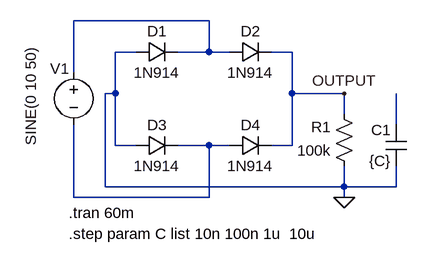
[diagram p0: schematic FullWaveBridgeRectifier.asc]
FullWaveBridgeRectifier.asc, the LTspice schematic file:
Version 4
SHEET 1 1288 680
WIRE 144 16 -64 16
WIRE 32 64 0 64
WIRE 144 64 144 16
WIRE 144 64 96 64
WIRE 176 64 144 64
WIRE 272 64 240 64
WIRE -64 96 -64 16
WIRE 0 128 0 64
WIRE 0 128 -16 128
WIRE 272 128 272 64
WIRE 352 128 272 128
WIRE 352 160 352 128
WIRE 432 176 432 128
WIRE 0 208 0 128
WIRE 32 208 0 208
WIRE 144 208 96 208
WIRE 176 208 144 208
WIRE 272 208 272 128
WIRE 272 208 240 208
WIRE -16 272 -16 128
WIRE 352 272 352 240
WIRE 352 272 -16 272
WIRE 432 272 432 240
WIRE 432 272 352 272
WIRE -64 288 -64 176
WIRE 144 288 144 208
WIRE 144 288 -64 288
WIRE 352 288 352 272
FLAG 352 288 0
FLAG 352 128 OUTPUT
SYMBOL voltage -64 80 R0
WINDOW 0 -36 10 Left 2
WINDOW 3 -66 -24 VRight 2
WINDOW 123 0 0 Left 0
WINDOW 39 0 0 Left 0
SYMATTR InstName V1
SYMATTR Value SINE(0 10 50)
SYMBOL diode 32 80 R270
WINDOW 0 32 32 VTop 2
WINDOW 3 0 32 VBottom 2
SYMATTR InstName D1
SYMATTR Value 1N914
SYMBOL diode 176 80 R270
WINDOW 0 32 32 VTop 2
WINDOW 3 0 32 VBottom 2
SYMATTR InstName D2
SYMATTR Value 1N914
SYMBOL diode 32 224 R270
WINDOW 0 32 32 VTop 2
WINDOW 3 0 32 VBottom 2
SYMATTR InstName D3
SYMATTR Value 1N914
SYMBOL diode 176 224 R270
WINDOW 0 32 32 VTop 2
WINDOW 3 0 32 VBottom 2
SYMATTR InstName D4
SYMATTR Value 1N914
SYMBOL res 368 256 R180
WINDOW 0 36 76 Left 2
WINDOW 3 36 40 Left 2
SYMATTR InstName R1
SYMATTR Value 100k
SYMBOL cap 448 240 R180
WINDOW 0 24 56 Left 2
WINDOW 3 24 8 Left 2
SYMATTR InstName C1
SYMATTR Value {C}
TEXT -72 312 Left 2 !.tran 60m
TEXT -72 344 Left 2 !.step param C list 10n 100n 1u  10u

The netlist it stands for:
* FullWaveBridgeRectifier.asc
V1 N001 N003 SINE(0 10 50)
D1 0 N001 1N914
D2 N001 OUTPUT 1N914
D3 0 N003 1N914
D4 N003 OUTPUT 1N914
R1 0 OUTPUT 100k
C1 0 N002 {C}
.model D D
.lib standard.dio
.tran 60m
.step param C list 10n 100n 1u  10u
.backanno
.end